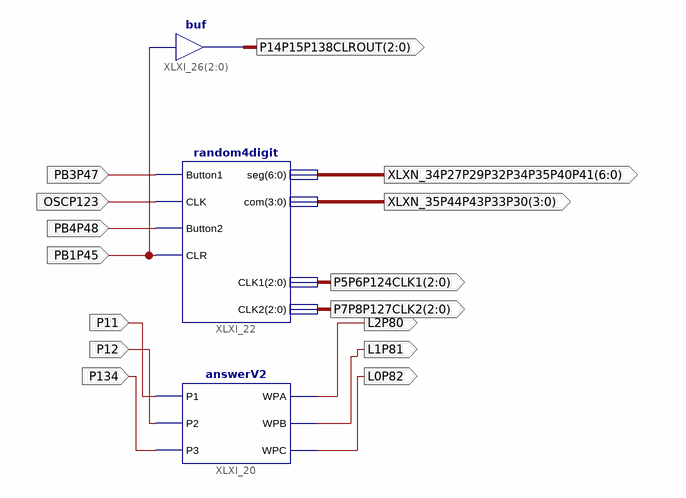
[diagram p0: schematic sheet 1]
// Xilinx ISE schematic main.sch (spartan6) as structural Verilog: 3 symbols, 15 ports
module main (
  input  PB1P45,
  input  PB3P47,
  input  OSCP123,
  input  PB4P48,
  input  P11,
  input  P12,
  input  P134,
  output [3:0] XLXN_35P44P43P33P30,
  output [6:0] XLXN_34P27P29P32P34P35P40P41,
  output L2P80,
  output L1P81,
  output L0P82,
  output [2:0] P5P6P124CLK1,
  output [2:0] P7P8P127CLK2,
  output [2:0] P14P15P138CLROUT
);

  random4digit XLXI_22 (
    .Button1(PB3P47), .CLK(OSCP123), .Button2(PB4P48), .CLR(PB1P45), .seg(XLXN_34P27P29P32P34P35P40P41),
    .com(XLXN_35P44P43P33P30), .CLK1(P5P6P124CLK1), .CLK2(P7P8P127CLK2));
  answerV2 XLXI_20 (.P1(P11), .P2(P12), .P3(P134), .WPA(L2P80), .WPB(L1P81), .WPC(L0P82));
  assign P14P15P138CLROUT = {3{PB1P45}};  // buf XLXI_26[2..0], 3 bits wide

  // Notes on the sheet:
  //   LOC on signal XLXN_35P44P43P33P30(3:0) = P44,P43,P33,P30
  //   LOC on signal PB1P45 = P45
  //   LOC on signal XLXN_34P27P29P32P34P35P40P41(6:0) = P27,P29,P32,P34,P35,P40,P41
  //   LOC on signal PB3P47 = P47
  //   LOC on signal OSCP123 = P123
  //   LOC on signal PB4P48 = P48
  //   LOC on signal L2P80 = P80
  //   LOC on signal L1P81 = P81
  //   LOC on signal L0P82 = P82
  //   LOC on signal P11 = P11
  //   LOC on signal P12 = P12
  //   LOC on signal P134 = P134
endmodule
